# Altium schematic sheet ATMEGA.SchDoc
size A; SheetNumber: 3; SheetTotal: 4
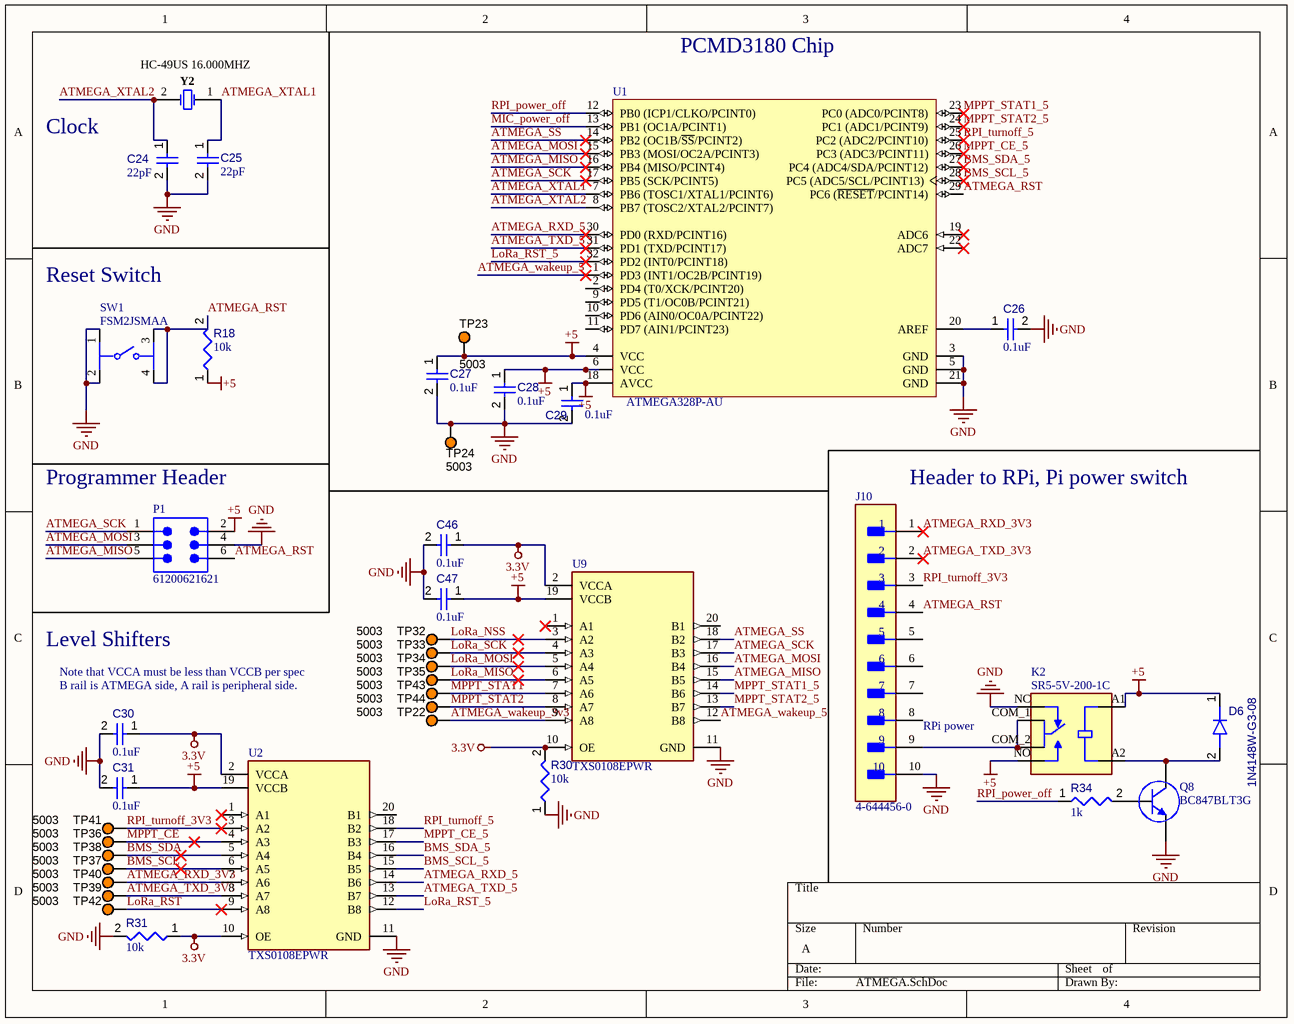
[diagram p0: ATMEGA.SchDoc]

## Parts
C24  value 22pF  [FP-C0603C-CF-IPC_B]  (hidden comment: C0603C220J5GACTU)
C25  value 22pF  [FP-C0603C-CF-IPC_B]  (hidden comment: C0603C220J5GACTU)
C26  value 0.1uF  [CAPC1608X90X40NL10T20]  (hidden comment: Capacitor 100 nF +/-10% 50 V 0603)
C27  value 0.1uF  [CAPC1608X90X40NL10T20]  (hidden comment: Capacitor 100 nF +/-10% 50 V 0603)
C28  value 0.1uF  [CAPC1608X90X40NL10T20]  (hidden comment: Capacitor 100 nF +/-10% 50 V 0603)
C29  value 0.1uF  [CAPC1608X90X40NL10T20]  (hidden comment: Capacitor 100 nF +/-10% 50 V 0603)
C30  value 0.1uF  [CAPC1608X90X40NL10T20]  (hidden comment: Capacitor 100 nF +/-10% 50 V 0603)
C31  value 0.1uF  [CAPC1608X90X40NL10T20]  (hidden comment: Capacitor 100 nF +/-10% 50 V 0603)
C46  value 0.1uF  [CAPC1608X90X40NL10T20]  (hidden comment: Capacitor 100 nF +/-10% 50 V 0603)
C47  value 0.1uF  [CAPC1608X90X40NL10T20]  (hidden comment: Capacitor 100 nF +/-10% 50 V 0603)
D6  1N4148W-G3-08  [FP-S8-V-3910_01-001-IPC_B]
J10  4-644456-0  [FP-4-644456-0-MFG]
K2  SR5-5V-200-1C  [RELAY_SR5-5V-200-1C]
P1  61200621621  [61200621621]
Q8  BC847BLT3G  [ONSC-SOT-23-3-318-08_V]
R18  value 10k  [RESC0603(1608)_L]  (hidden comment: Resistor 120R +/-5 % 0603 0.1 W)
R30  value 10k  [RESC0603(1608)_L]  (hidden comment: Resistor 120R +/-5 % 0603 0.1 W)
R31  value 10k  [RESC0603(1608)_L]  (hidden comment: Resistor 120R +/-5 % 0603 0.1 W)
R34  value 1k  [RESC0603(1608)_L]  (hidden comment: Resistor 120R +/-5 % 0603 0.1 W)
SW1  FSM2JSMAA  [FP-FSM2JSMAA-MFG]
TP22  5003  [KSTN-5003]
TP23  5003  [KSTN-5003]
TP24  5003  [KSTN-5003]
TP32  5003  [KSTN-5003]
TP33  5003  [KSTN-5003]
TP34  5003  [KSTN-5003]
TP35  5003  [KSTN-5003]
TP36  5003  [KSTN-5003]
TP37  5003  [KSTN-5003]
TP38  5003  [KSTN-5003]
TP39  5003  [KSTN-5003]
TP40  5003  [KSTN-5003]
TP41  5003  [KSTN-5003]
TP42  5003  [KSTN-5003]
TP43  5003  [KSTN-5003]
TP44  5003  [KSTN-5003]
U1  ATMEGA328P-AU  [ATML-32A_M]
U2  TXS0108EPWR  [FP-PW0020A-IPC_A]
U9  TXS0108EPWR  [FP-PW0020A-IPC_A]
Y2  HC-49US 16.000MHZ  [JPY-HC-49US]

## Nets
3.3V: C30.1 C46.1 R30.2 R31.1 U2.2(VCCA) U2.10(OE) U9.2(VCCA) U9.10(OE)
+5: C27.1 C28.1 C29.1 C31.1 C47.1 D6.1(K) K2.A1(COIL1) K2.NO P1.2 R18.1 TP23.1 U1.4(VCC) U1.6(VCC) U1.18(AVCC) U2.19(VCCB) U9.19(VCCB)
GND: C24.2 C25.2 C26.2 C27.2 C28.2 C29.2 C30.2 C31.2 C46.2 C47.2 J10.10 K2.NC P1.4 Q8.1(E) R30.1 R31.2 SW1.1 SW1.2 TP24.1 U1.3(GND) U1.5(GND) U1.21(GND) U2.11(GND) U9.11(GND)
ATMEGA_MISO: P1.5 U1.16(PB4_(MISO/PCINT4)) U9.15(B5)
ATMEGA_MOSI: P1.3 U1.15(PB3_(MOSI/OC2A/PCINT3)) U9.16(B4)
ATMEGA_RST: J10.4 P1.6 R18.2 SW1.3 SW1.4 U1.29(PC6_(~{RESET}/PCINT14))
ATMEGA_RXD_3V3: J10.1 TP40.1 U2.7(A6)
ATMEGA_RXD_5: U1.30(PD0_(RXD/PCINT16)) U2.14(B6)
ATMEGA_SCK: P1.1 U1.17(PB5_(SCK/PCINT5)) U9.17(B3)
ATMEGA_SS: U1.14(PB2_(OC1B/~{SS}/PCINT2)) U9.18(B2)
ATMEGA_TXD_3V3: J10.2 TP39.1 U2.8(A7)
ATMEGA_TXD_5: U1.31(PD1_(TXD/PCINT17)) U2.13(B7)
ATMEGA_wakeup_3v3: TP22.1 U9.9(A8)
ATMEGA_wakeup_5: U1.1(PD3_(INT1/OC2B/PCINT19)) U9.12(B8)
ATMEGA_XTAL1: C25.1 U1.7(PB6_(TOSC1/XTAL1/PCINT6)) Y2.1
ATMEGA_XTAL2: C24.1 U1.8(PB7_(TOSC2/XTAL2/PCINT7)) Y2.2
BMS_SCL: TP37.1 U2.6(A5)
BMS_SCL_5: U1.28(PC5_(ADC5/SCL/PCINT13)) U2.15(B5)
BMS_SDA: TP38.1 U2.5(A4)
BMS_SDA_5: U1.27(PC4_(ADC4/SDA/PCINT12)) U2.16(B4)
LoRa_MISO: TP35.1 U9.6(A5)
LoRa_MOSI: TP34.1 U9.5(A4)
LoRa_NSS: TP32.1 U9.3(A2)
LoRa_RST: TP42.1 U2.9(A8)
LoRa_RST_5: U1.32(PD2_(INT0/PCINT18)) U2.12(B8)
LoRa_SCK: TP33.1 U9.4(A3)
MIC_power_off: U1.13(PB1_(OC1A/PCINT1))
MPPT_CE: TP36.1 U2.4(A3)
MPPT_CE_5: U1.26(PC3_(ADC3/PCINT11)) U2.17(B3)
MPPT_STAT1: TP43.1 U9.7(A6)
MPPT_STAT1_5: U1.23(PC0_(ADC0/PCINT8)) U9.14(B6)
MPPT_STAT2: TP44.1 U9.8(A7)
MPPT_STAT2_5: U1.24(PC1_(ADC1/PCINT9)) U9.13(B7)
RPI_power_off: R34.1 U1.12(PB0_(ICP1/CLKO/PCINT0))
RPI_turnoff_3V3: J10.3 TP41.1 U2.3(A2)
RPI_turnoff_5: U1.25(PC2_(ADC2/PCINT10)) U2.18(B2)
NetC26_1: C26.1 U1.20(AREF)
NetD6_2: D6.2(A) K2.A2(COIL2) Q8.3(C)
NetJ10_9: J10.9 K2.COM_1(COM1) K2.COM_2(COM2)
NetQ8_2: Q8.2(B) R34.2

Not connected (* = marked no-connect by the designer): J10 5 6 7 8; U1 2(PD4_(T0/XCK/PCINT20)) 9(PD5_(T1/OC0B/PCINT21)) 10(PD6_(AIN0/OC0A/PCINT22)) 11(PD7_(AIN1/PCINT23)) 19(ADC6)* 22(ADC7)*; U2 1(A1)* 20(B1); U9 1(A1)* 20(B1)

## Notes on the sheet
- PCMD3180 Chip
- Clock
- Reset Switch
- (near P1) Programmer Header
- (near J10) Header to RPi, Pi power switch
- Level Shifters
- Note that VCCA must be less than VCCB per spec
- (near C30) B rail is ATMEGA side, A rail is peripheral side.
- (near J10) RPi power

## Library data of the parts
C24 C25 = CMP-001-00083-1: Ceramic Capacitor, Multilayer, Ceramic, 50V, 5% +Tol, 5% -Tol, C0G, 30ppm/Cel TC, 0.000022uF, Surface Mount, 0603; Mounting Technology: Surface Mount; Pins: 2; Max Operating Temperature: 125°C; Capacitor Type: Ceramic; RoHS Compliant: Yes; Min Operating Temperature: -55°C; Case/Package: 0603
C26-C31 C46 C47 = CMP-001-00017-6: Chip Capacitor, 100 nF, +/- 10%, 50 V, 0603 (1608 Metric); Voltage Rating: 50V; Capacitor Type: Ceramic; Tolerance: 10%; Mounting Technology: SM; Max Operating Temperature: 125°C; RoHS Compliant: True; Pins: 2; Case/Package: 0603; Min Operating Temperature: -55°C
D6 = CMP-004-00034-1: Rectifier Diode, 1 Phase, 1 Element, 0.15A, 100V V(RRM), Silicon
J10 = CMP-002-00072-1: Board Connector, 10 Contact(s), 1 Row(s), Male, Straight, 0.1 inch Pitch, Solder Terminal, Natural Insulator, Plug; Min Operating Temperature: -55°C; RoHS Compliant: Yes; Mounting Technology: Board; Max Operating Temperature: 105°C; Connector Type: BOARD CONNECTOR
K2 = CMP-029-000000-1: 15.6 x 10.6 x 11.8 mm, 5 V, 1 A, SPDT (1 Form C), Through Hole, Signal Relay; MF: CUI Devices; Pin Count: 6; Component Type: Standard; MP: SR5-5V-200-1C; Design Item ID: SR5-5V-200-1C; Package: None; CUI_purchase_URL: https://www.cuidevices.com/product/relays/signal-relays/sr5-5v-200-1c?utm_source=snapeda.com&utm_medium=referral&utm_campaign=snapedaBOM; Source: SR5-5V-200-1C.SchLib; SnapEDA_Link: https://www.snapeda.com/parts/SR5-5V-200-1C/CUI+Devices/view-part/?ref=snap; Value: *; Check_prices: https://www.snapeda.com/parts/SR5-5V-200-1C/CUI+Devices/view-part/?ref=eda
P1 = CMP-002-00075-1: Board Connector, 6 Contact(s), 2 Row(s), Male, Straight, Solder Terminal; RoHS Compliant: Yes; Connector Type: BOARD CONNECTOR; Mounting Technology: Board
Q8 = CMP-013-00036-1: Small Signal Bipolar Transistor, 0.1A I(C), 45V V(BR)CEO, 1-Element, NPN, Silicon, TO-236; Frequency: 100MHz; RoHS Compliant: Yes; Max Operating Temperature: 150°C; Pins: 3
R18 R30 R31 R34 = CMP-009-00176-3: Chip Resistor, 120 Ohms, +/-5 %, 0.1 W, -55 to 155 degC, 0603; Power: 100mW; Tolerance: 5%; Max Operating Temperature: 155°C; Pins: 2; Case/Package: 0603; Min Operating Temperature: -55°C
SW1 = CMP-011-00013-1: Keypad Switch, 1 Switches, SPST, Momentary-tactile, 0.05A, 24VDC, 3.04N, Solder Terminal, Surface Mount-straight; RoHS Compliant: Yes; Max Operating Temperature: 85°C; Mounting Technology: Surface Mount; Min Operating Temperature: -20°C
TP22-TP24 TP32-TP44 = CMP-002-00037-2: Test Point, Orange, Height 4.6 mm, Tail Length 3 mm, 1-Pin THD, RoHS; Manufacturer: Keystone; Colour: Orange; Packaging: Bulk; Package Description: 1-Pin Through Hole Device, Dia 2.54 mm; Pins: 1; Package Reference: 5003; Datasheet Version: Jun-15; Case/Package: 5003; Mounting Technology: TH; Connector Type: TestPoint; Diameter: 2.54mm; Contact Material: Bronze; Datasheet URL: http://keyelco.com/userAssets/file/M65p56.pdf; Manufacturer URL: http://www.keyelco.com/; Package Quantity: 10; Contact Plating: Tin; RoHS Compliant: True
U1 = CMP-020-00003-3: 8-Bit Microcontroller with 32 KBytes In-System Programmable Flash, 23 I/Os, -40 to 85 degC, 32-Pin TQFP (32A), RoHS, Tray; Manufacturer: Atmel; PWM Channels: 6; Frequency: 20MHz; RAM Size: 2KB; ADC Channels: 8; Max Supply Voltage: 5.5V; Density: 32KB; USB Channels: 0; I/Os: 23; Min Supply Voltage: 1.8V; Interface: USART; Package Reference: 32A; Package Description: 32-Pin Thin Profile Plastic Quad Flat Package, Body 7 x 7 mm, Pitch 0.8 mm; Max Operating Temperature: 85°C; Mounting Technology: SM; Datasheet URL: http://www.atmel.com/images/Atmel-8271-8-bit-AVR-Microcontroller-ATmega48A-48PA-88A-88PA-168A-168PA-328-328P_datasheet_Complete.pdf; Pins: 32; Packaging: Tray; RoHS Compliant: True; Max Clock Frequency: 20MHz; Ethernet Channels: 0; Clock Frequency: 20MHz; Case/Package: TQFP; Manufacturer URL: http://www.atmel.com/; Datasheet Version: Rev. 8271J, 11/2015; Package Quantity: 250; Min Operating Temperature: -40°C
U2 U9 = CMP-019-00054-1: Interface Circuit, PDSO20; Max Supply Voltage: 3.6V; Min Supply Voltage: 1.2V; Min Operating Temperature: -40°C; Case/Package: TSSOP; Max Operating Temperature: 85°C; RoHS Compliant: Yes; Pins: 20
Y2 = CMP-003-00005-2: Crystal, 16 MHz, +/- 30 ppm, 18 pF, -20 to 70 degC, 2-Pin THD; Manufacturer: Jing peng yuan; Frequency: 16MHz; Package Reference: HC-49US; Case/Package: HC-49US; RoHS Compliant: Unknown; Mounting Technology: TH; Package Description: 2-Pin Throug Hole Device, Body 11.05 x 4.65 mm, Pitch 4.9 mm; Datasheet URL: https://statics3.seeedstudio.com/images/opl/datasheet/306010014.pdf; Datasheet Version: May-15